# Altium project FAN_Boardv1_040116.PrjPcb
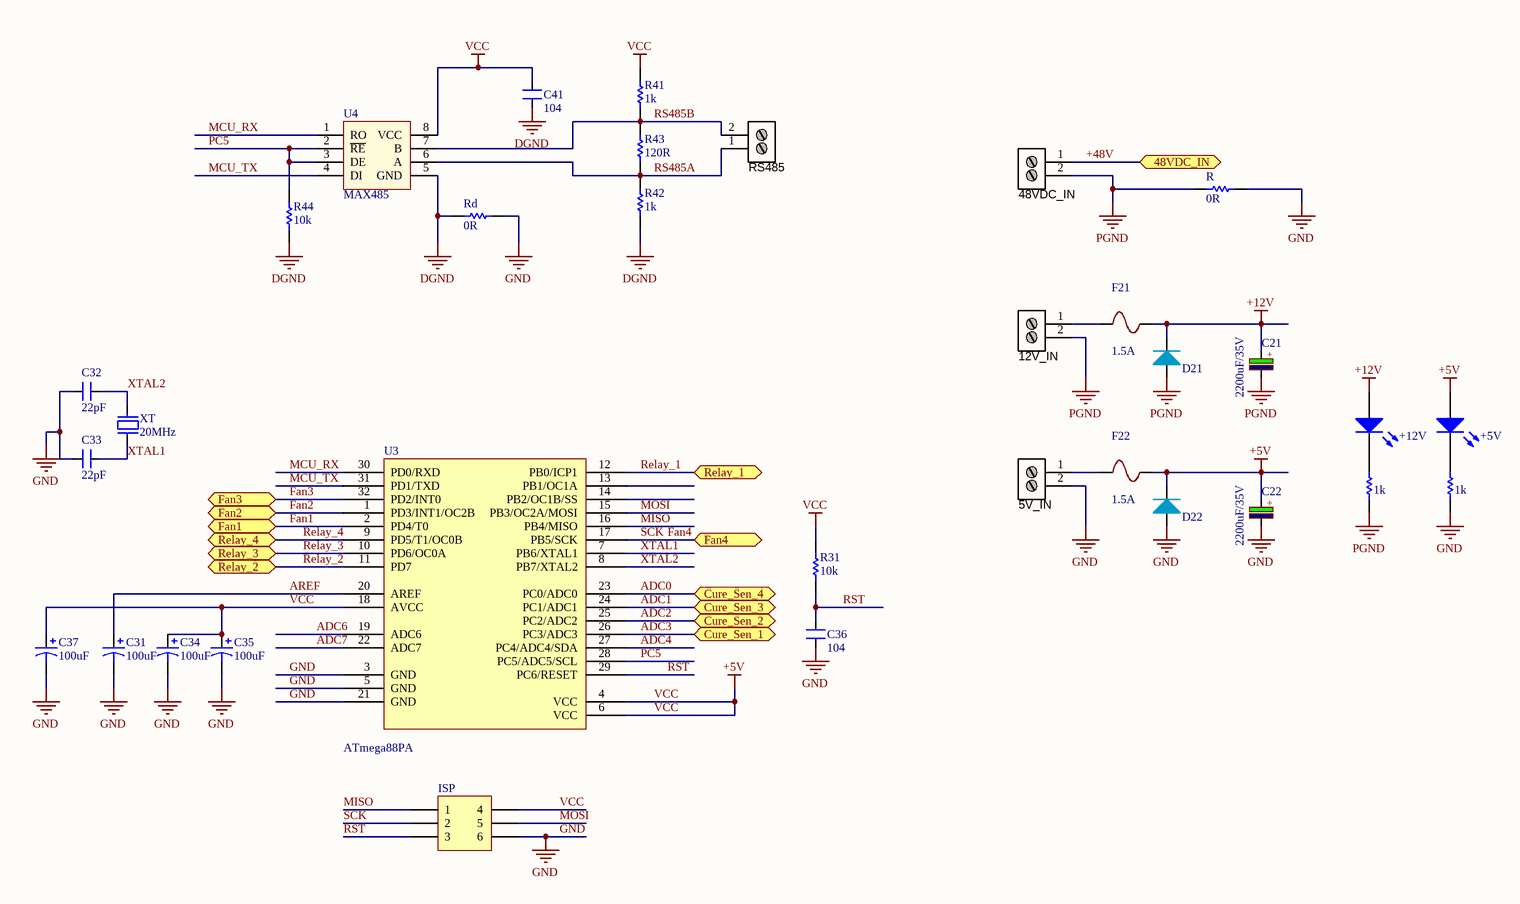
[diagram p0: FAN_Board_Control_v1_040116.SchDoc]
2 sheets, 104 parts. Net scope: flat (ports and power ports of the same name join across sheets).
Board file: FAN_Boardv1_040116.PcbDoc
Sheets:
  FAN_Board_Control_v1_040116.SchDoc
  FAN_Boardv1_RelayAlarm_040116.SchDoc

## Sheet FAN_Board_Control_v1_040116.SchDoc
size A3

### Parts
5V_IN  Stackable ScrewTerm  [2P_PCB_ScrewTerm_200mil]  (value not drawn)
12V_IN  Stackable ScrewTerm  [2P_PCB_ScrewTerm_200mil]  (value not drawn)
48VDC_IN  Stackable ScrewTerm  [2P_PCB_ScrewTerm_200mil]  (value not drawn)
+5V  Led  [LED 5mm RED]  (value not drawn)
+12V  Led  [LED 5mm RED]  (value not drawn)
C21  2200uF/35V  [CP_1000uF_25V]
C22  2200uF/35V  [CP_1000uF_25V]
C31  value 100uF  [CAPC2012N_F]  (hidden comment: Cap)
C32  value 22pF  [CAPC1608N]  (hidden comment: CAP NP)
C33  value 22pF  [CAPC1608N]  (hidden comment: CAP NP)
C34  value 100uF  [CAPC2012N_F]  (hidden comment: Cap)
C35  value 100uF  [CAPC2012N_F]  (hidden comment: Cap)
C36  value 104  [CAPC1608N]  (hidden comment: CAP NP)
C37  value 100uF  [CAPC2012N_F]  (hidden comment: Cap)
C41  value 104  [CAPC2012N_F]  (hidden comment: 100nF/104)
D21  Diode  [DO-214AC]  (value not drawn)
D22  Diode  [DO-214AC]  (value not drawn)
F21  1.5A  [FUSE_SR-5-BK]
F22  1.5A  [FUSE_SR-5-BK]
ISP  Header 3X2A  [HDR2X3_CEN]  (value not drawn)
R  value 0R  [RESTH_AXIAL-0.4]  (hidden comment: Res)
R21  value 1k  [RESC2012N_F]  (hidden comment: Res_0805_1k)
R22  value 1k  [RESC2012N_F]  (hidden comment: Res_0805_1k)
R31  value 10k  [RESC1608N_ZERO]  (hidden comment: Res)
R41  1k  [RESC2012N_F]
R42  1k  [RESC2012N_F]
R43  value 120R  [RESC2012N_F]  (hidden comment: 330R)
R44  value 10k  [RESC2012N_F]  (hidden comment: 330R)
Rd  value 0R  [RESC2012N_F]  (hidden comment: Res)
RS485  Stackable ScrewTerm  [2P_PCB1]  (value not drawn)
U3  ATmega88PA  [32PIN]
U4  MAX485  [SO-8]
XT  20MHz  [XT2]

### Ports
48VDC_IN, Cure_Sen_1, Cure_Sen_2, Cure_Sen_3, Cure_Sen_4, Fan1, Fan2, Fan3, Fan4, Relay_1, Relay_2, Relay_3, Relay_4

### Nets
+12V: +12V.1(A) C21.1 D21.2(K) F21.2
DGND: C41.1 R42.1 R44.1 Rd.1 U4.5(GND)
GND: 5V_IN.2 C22.2 C31.2 C32.2 C33.2 C34.2 C35.2 C36.1 C37.2 D22.1(A) ISP.6 R.2 R22.2 Rd.2 U3.3(GND) U3.5(GND) U3.21(GND)
PGND: 12V_IN.2 48VDC_IN.2 C21.2 D21.1(A) R.1 R21.2
VCC: +5V.1(A) C22.1 C34.1 C35.1 C37.1 C41.2 D22.2(K) F22.2 ISP.4 R31.2 R41.2 U3.4(VCC) U3.6(VCC) U3.18(AVCC) U4.8(VCC)  [also labelled +5V]
+48V: 48VDC_IN.1 ; port 48VDC_IN
ADC0: U3.23(PC0/ADC0) ; port Cure_Sen_4
ADC1: U3.24(PC1/ADC1) ; port Cure_Sen_3
ADC2: U3.25(PC2/ADC2) ; port Cure_Sen_2
ADC3: U3.26(PC3/ADC3) ; port Cure_Sen_1
ADC4: U3.27(PC4/ADC4/SDA)
ADC6: U3.19(ADC6)
ADC7: U3.22(ADC7)
AREF: C31.1 U3.20(AREF)
Fan1: U3.2(PD4/T0) ; port Fan1
Fan2: U3.1(PD3/INT1/OC2B) ; port Fan2
Fan3: U3.32(PD2/INT0) ; port Fan3
Fan4: ISP.2 U3.17(PB5/SCK) ; port Fan4  [also labelled SCK]
MCU_RX: U3.30(PD0/RXD) U4.1(RO)
MCU_TX: U3.31(PD1/TXD) U4.4(DI)
MISO: ISP.1 U3.16(PB4/MISO)
MOSI: ISP.5 U3.15(PB3/OC2A/MOSI)
PC5: R44.2 U3.28(PC5/ADC5/SCL) U4.2(~{RE}) U4.3(DE)
Relay_1: U3.12(PB0/ICP1) ; port Relay_1
Relay_2: U3.11(PD7) ; port Relay_2
Relay_3: U3.10(PD6/OC0A) ; port Relay_3
Relay_4: U3.9(PD5/T1/OC0B) ; port Relay_4
RS485A: R42.2 R43.1 RS485.1 U4.6(A)
RS485B: R41.1 R43.2 RS485.2 U4.7(B)
RST: C36.2 ISP.3 R31.1 U3.29(PC6/RESET)
XTAL1: C33.1 U3.7(PB6/XTAL1) XT.1
XTAL2: C32.1 U3.8(PB7/XTAL2) XT.2
Net5V_IN_1: 5V_IN.1 F22.1
Net12V_IN_1: 12V_IN.1 F21.1
Net+5V_2: +5V.2(K) R22.1
Net+12V_2: +12V.2(K) R21.1

Not connected (* = marked no-connect by the designer): U3 13(PB1/OC1A) 14(PB2/OC1B/SS)

### Notes on the sheet
- (in symbol CP4) +

### Library data of the parts
5V_IN 12V_IN 48VDC_IN RS485 = 2P_ScrewTerm_90S_3.81MM: Terminal Block Screw Type THT 2-Position 3.81mm pitch; Manufacturer 1: Tyco Electronics; Manufacturer Part Number 1: 1776113-2; Value: 2 position; Pitch: 0.150" (3.81mm); Positions Per Level: 2; Package / Case: Side Entry; 3.81mm pitch; Category: Connectors Interconnects; Color: Black; Supplier 1: Digi-Key; Supplier Part Number 1: A97976-ND
+5V +12V = Led: pin to pad: 1>A 2>K
C21 C22 = CP4: Cap 1000uF/16V - 220uF/50V; Description 5: 4,7uF>10uF/250V_3,3uF>10uF/400V - 2,2uF>4,7uF/450V; Description 1: 2200uF-3300uF/6,3V - 1000uF-2200uF/10V; Description 2: 1000uF/16V - 470uF => 1000uF/25V - 100uF/100V; Description 3: 330uF>470uF/35V_220uF>470uF/50V_10uF>22uF/250V; Description 4: 220uF => 330uF/63V - 10uF =>33uF/160 - 200V; Value: 1000uF/16V
C41 = CAP NP
D21 D22 = Diode: pin to pad: 1>A 2>K
F21 F22 = Fuse
ISP = Header 3X2A: Header, 3-Pin, Dual row; LatestRevisionDate: 17-Jul-2002; LatestRevisionNote: Re-released for DXP Platform.; Publisher: Altium Limited
R21 R22 = Res
R41-R44 = Res: Tro dan
  R41 R42: Value: 1k
U3 = ATmega48/168/328
U4 = MAX485: RS232 - RS485 (Same sn75176)
XT = Crystal

## Sheet FAN_Boardv1_RelayAlarm_040116.SchDoc
size A3
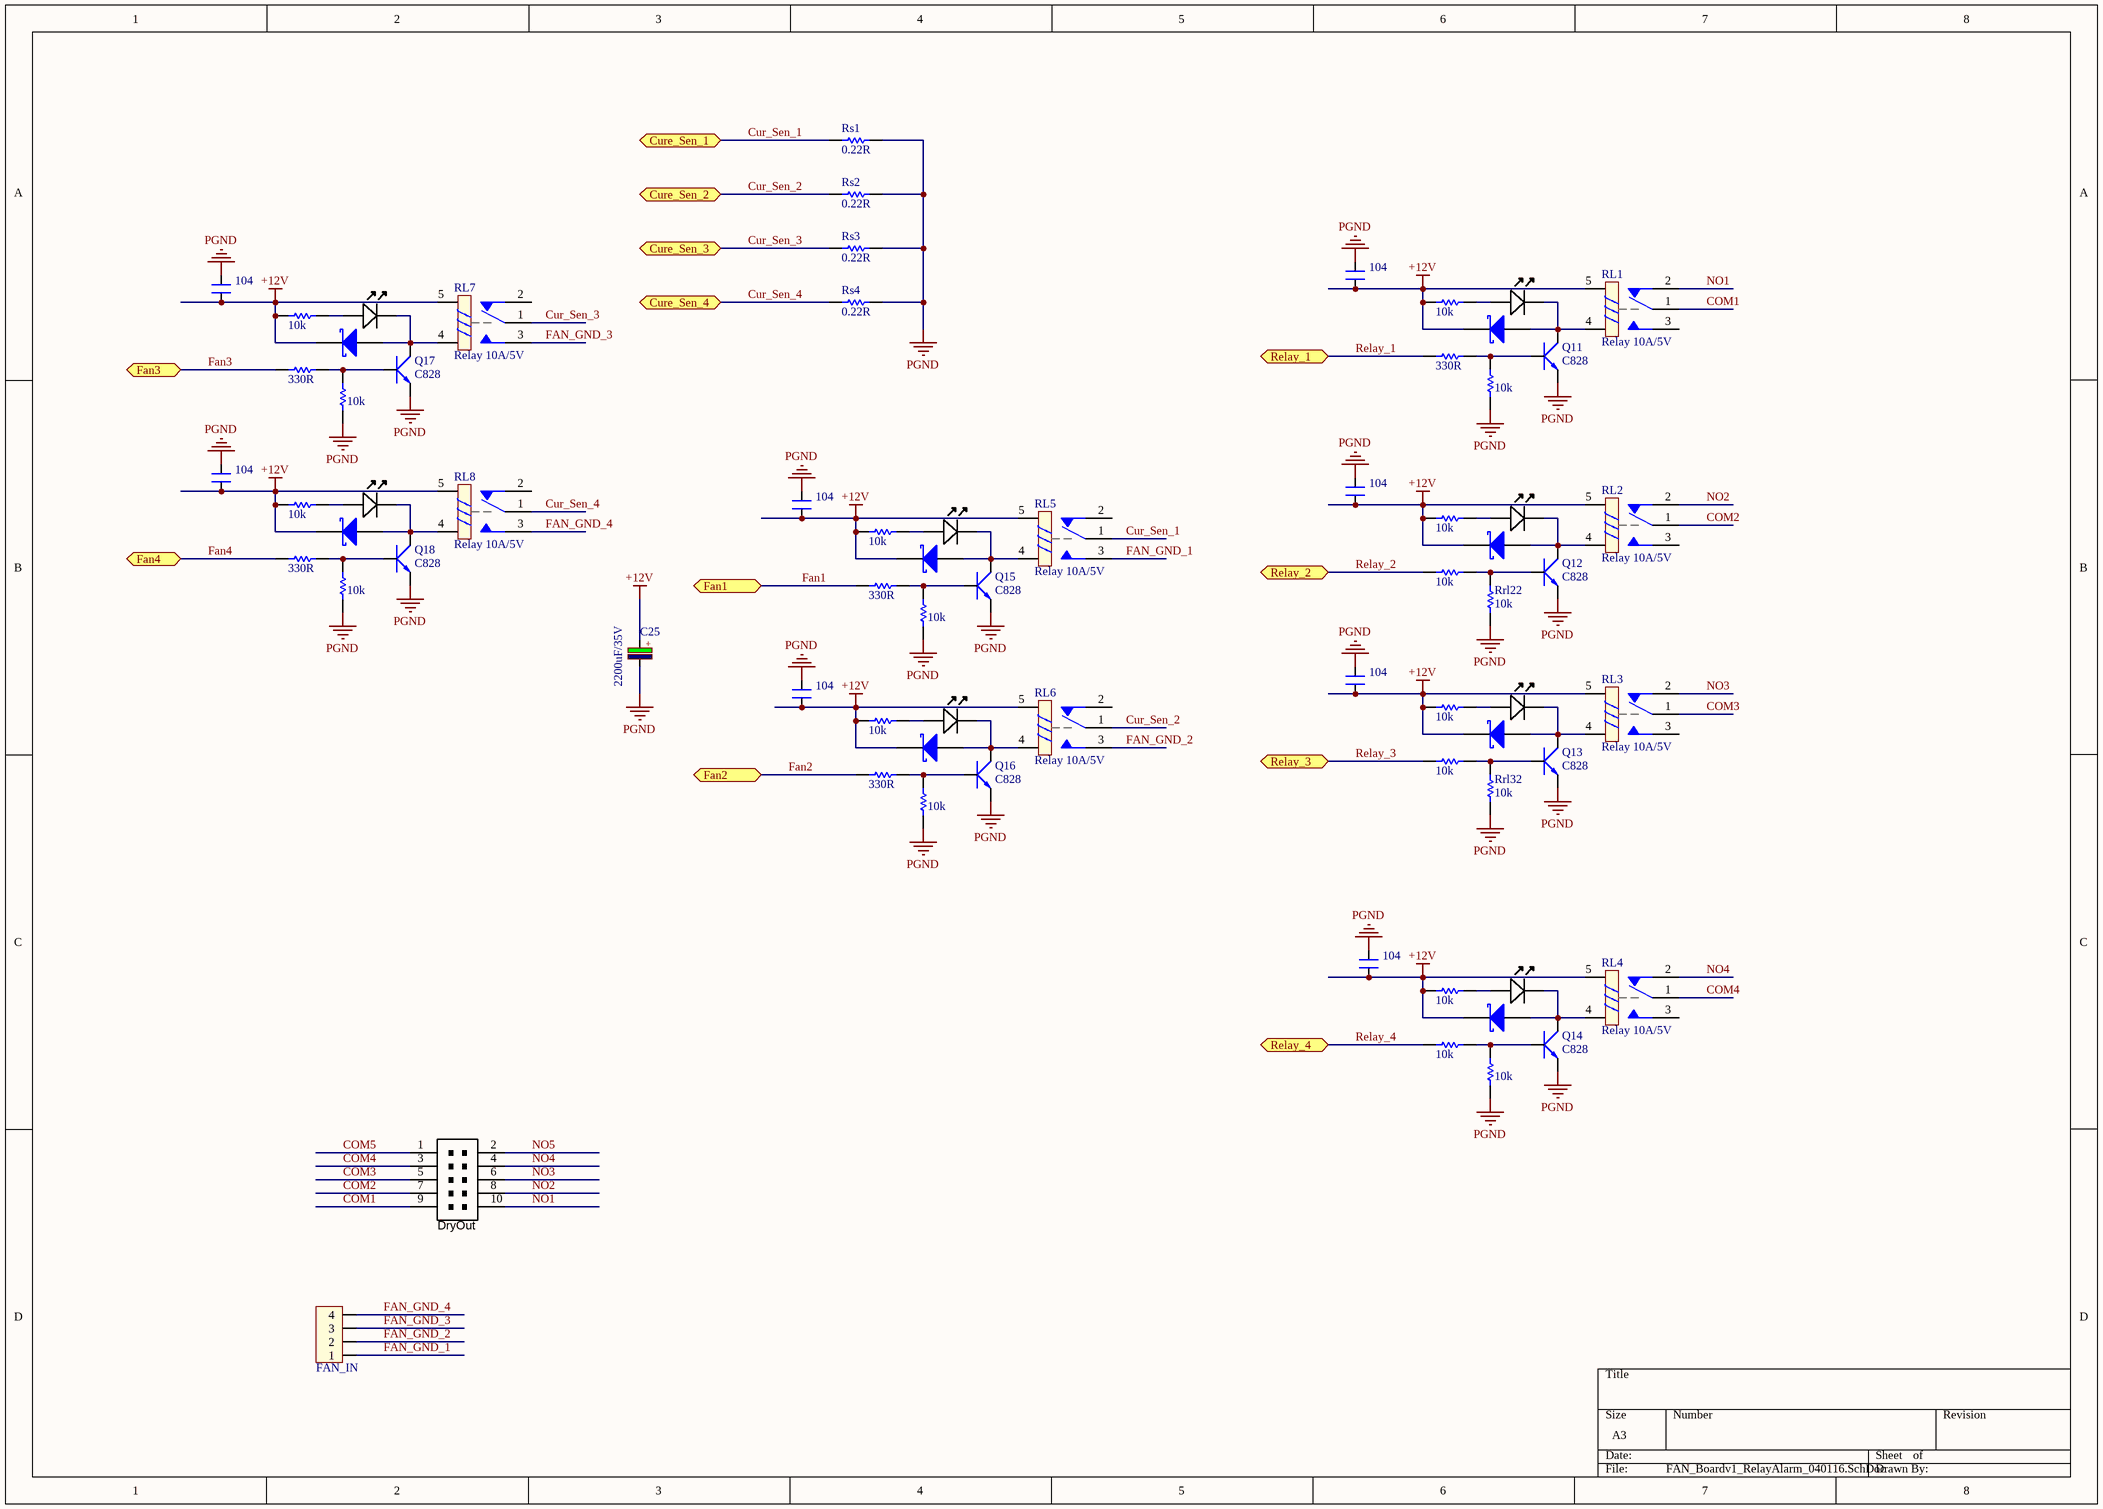
[diagram p1: FAN_Boardv1_RelayAlarm_040116.SchDoc]

### Parts
C25  2200uF/35V  [CP_1000uF_25V]
Crl1  value 104  [CAPC2012N_F]  (hidden comment: CAP NP)
Crl2  value 104  [CAPC2012N_F]  (hidden comment: CAP NP)
Crl3  value 104  [CAPC2012N_F]  (hidden comment: CAP NP)
Crl4  value 104  [CAPC2012N_F]  (hidden comment: CAP NP)
Crl5  value 104  [CAPC2012N_F]  (hidden comment: CAP NP)
Crl6  value 104  [CAPC2012N_F]  (hidden comment: CAP NP)
Crl7  value 104  [CAPC2012N_F]  (hidden comment: CAP NP)
Crl8  value 104  [CAPC2012N_F]  (hidden comment: CAP NP)
D11  Diode  [DO-214AC]  (value not drawn)
D12  Diode  [DO-214AC]  (value not drawn)
D13  Diode  [DO-214AC]  (value not drawn)
D14  Diode  [DO-214AC]  (value not drawn)
D15  Diode  [DO-214AC]  (value not drawn)
D16  Diode  [DO-214AC]  (value not drawn)
D17  Diode  [DO-214AC]  (value not drawn)
D18  Diode  [DO-214AC]  (value not drawn)
DryOut  shrouded box header  [10P_PCB_HEADER_BRD_MNT]  (value not drawn)
E1  Blue  [LED-0805-A]  (value not drawn)
E2  Blue  [LED-0805-A]  (value not drawn)
E3  Blue  [LED-0805-A]  (value not drawn)
E4  Blue  [LED-0805-A]  (value not drawn)
E5  Blue  [LED-0805-A]  (value not drawn)
E6  Blue  [LED-0805-A]  (value not drawn)
E7  Blue  [LED-0805-A]  (value not drawn)
E8  Blue  [LED-0805-A]  (value not drawn)
FAN_IN  Header 4  [HED4]  (value not drawn)
Q11  C828  [SOT23 TOP]
Q12  C828  [SOT23 TOP]
Q13  C828  [SOT23 TOP]
Q14  C828  [SOT23 TOP]
Q15  C828  [SOT23 TOP]
Q16  C828  [SOT23 TOP]
Q17  C828  [SOT23 TOP]
Q18  C828  [SOT23 TOP]
RL1  Relay 10A/5V  [RL_5PIN]
RL2  Relay 10A/5V  [RL_5PIN]
RL3  Relay 10A/5V  [RL_5PIN]
RL4  Relay 10A/5V  [RL_5PIN]
RL5  Relay 10A/5V  [RL_5PIN]
RL6  Relay 10A/5V  [RL_5PIN]
RL7  Relay 10A/5V  [RL_5PIN]
RL8  Relay 10A/5V  [RL_5PIN]
Rl52  value 10k  [RESC1608N_ZERO]  (hidden comment: Res)
Rrl11  value 330R  [RESC1608N_ZERO]  (hidden comment: Res)
Rrl12  value 10k  [RESC1608N_ZERO]  (hidden comment: Res)
Rrl13  value 10k  [RESC1608N_ZERO]  (hidden comment: Res)
Rrl21  value 10k  [RESC1608N_ZERO]  (hidden comment: Res)
Rrl22  value 10k  [RESC1608N_ZERO]  (hidden comment: Res)
Rrl23  value 10k  [RESC1608N_ZERO]  (hidden comment: Res)
Rrl31  value 10k  [RESC1608N_ZERO]  (hidden comment: Res)
Rrl32  value 10k  [RESC1608N_ZERO]  (hidden comment: Res)
Rrl33  value 10k  [RESC1608N_ZERO]  (hidden comment: Res)
Rrl41  value 10k  [RESC1608N_ZERO]  (hidden comment: Res)
Rrl42  value 10k  [RESC1608N_ZERO]  (hidden comment: Res)
Rrl43  value 10k  [RESC1608N_ZERO]  (hidden comment: Res)
Rrl51  value 330R  [RESC1608N_ZERO]  (hidden comment: Res)
Rrl53  value 10k  [RESC1608N_ZERO]  (hidden comment: Res)
Rrl61  value 330R  [RESC1608N_ZERO]  (hidden comment: Res)
Rrl62  value 10k  [RESC1608N_ZERO]  (hidden comment: Res)
Rrl63  value 10k  [RESC1608N_ZERO]  (hidden comment: Res)
Rrl71  value 330R  [RESC1608N_ZERO]  (hidden comment: Res)
Rrl72  value 10k  [RESC1608N_ZERO]  (hidden comment: Res)
Rrl73  value 10k  [RESC1608N_ZERO]  (hidden comment: Res)
Rrl81  value 330R  [RESC1608N_ZERO]  (hidden comment: Res)
Rrl82  value 10k  [RESC1608N_ZERO]  (hidden comment: Res)
Rrl83  value 10k  [RESC1608N_ZERO]  (hidden comment: Res)
Rs1  value 0.22R  [RESTH_AXIAL-0.4]  (hidden comment: Res)
Rs2  value 0.22R  [RESTH_AXIAL-0.4]  (hidden comment: Res)
Rs3  value 0.22R  [RESTH_AXIAL-0.4]  (hidden comment: Res)
Rs4  value 0.22R  [RESTH_AXIAL-0.4]  (hidden comment: Res)

### Ports
Cure_Sen_1, Cure_Sen_2, Cure_Sen_3, Cure_Sen_4, Fan1, Fan2, Fan3, Fan4, Relay_1, Relay_2, Relay_3, Relay_4

### Nets
+12V: C25.1 Crl1.1 Crl2.1 Crl3.1 Crl4.1 Crl5.1 Crl6.1 Crl7.1 Crl8.1 D11.2(K) D12.2(K) D13.2(K) D14.2(K) D15.2(K) D16.2(K) D17.2(K) D18.2(K) RL1.5 RL2.5 RL3.5 RL4.5 RL5.5 RL6.5 RL7.5 RL8.5 Rrl13.2 Rrl23.2 Rrl33.2 Rrl43.2 Rrl53.2 Rrl63.2 Rrl73.2 Rrl83.2
PGND: C25.2 Crl1.2 Crl2.2 Crl3.2 Crl4.2 Crl5.2 Crl6.2 Crl7.2 Crl8.2 Q11.3(E) Q12.3(E) Q13.3(E) Q14.3(E) Q15.3(E) Q16.3(E) Q17.3(E) Q18.3(E) Rl52.1 Rrl12.1 Rrl22.1 Rrl32.1 Rrl42.1 Rrl62.1 Rrl72.1 Rrl82.1 Rs1.1 Rs2.1 Rs3.1 Rs4.1
COM1: DryOut.9 RL1.1
COM2: DryOut.7 RL2.1
COM3: DryOut.5 RL3.1
COM4: DryOut.3 RL4.1
COM5: DryOut.1
Cur_Sen_1: RL5.1 Rs1.2 ; port Cure_Sen_1  [project net ADC3]
Cur_Sen_2: RL6.1 Rs2.2 ; port Cure_Sen_2  [project net ADC2]
Cur_Sen_3: RL7.1 Rs3.2 ; port Cure_Sen_3  [project net ADC1]
Cur_Sen_4: RL8.1 Rs4.2 ; port Cure_Sen_4  [project net ADC0]
Fan1: Rrl51.1 ; port Fan1
Fan2: Rrl61.1 ; port Fan2
Fan3: Rrl71.1 ; port Fan3
Fan4: Rrl81.1 ; port Fan4
FAN_GND_1: FAN_IN.1 RL5.3
FAN_GND_2: FAN_IN.2 RL6.3
FAN_GND_3: FAN_IN.3 RL7.3
FAN_GND_4: FAN_IN.4 RL8.3
NO1: DryOut.10 RL1.2
NO2: DryOut.8 RL2.2
NO3: DryOut.6 RL3.2
NO4: DryOut.4 RL4.2
NO5: DryOut.2
Relay_1: Rrl11.1 ; port Relay_1
Relay_2: Rrl21.1 ; port Relay_2
Relay_3: Rrl31.1 ; port Relay_3
Relay_4: Rrl41.1 ; port Relay_4
NetD11_1: D11.1(A) E1.K Q11.2(C) RL1.4
NetD12_1: D12.1(A) E2.K Q12.2(C) RL2.4
NetD13_1: D13.1(A) E3.K Q13.2(C) RL3.4
NetD14_1: D14.1(A) E4.K Q14.2(C) RL4.4
NetD15_1: D15.1(A) E5.K Q15.2(C) RL5.4
NetD16_1: D16.1(A) E6.K Q16.2(C) RL6.4
NetD17_1: D17.1(A) E7.K Q17.2(C) RL7.4
NetD18_1: D18.1(A) E8.K Q18.2(C) RL8.4
NetE1_A: E1.A Rrl13.1
NetE2_A: E2.A Rrl23.1
NetE3_A: E3.A Rrl33.1
NetE4_A: E4.A Rrl43.1
NetE5_A: E5.A Rrl53.1
NetE6_A: E6.A Rrl63.1
NetE7_A: E7.A Rrl73.1
NetE8_A: E8.A Rrl83.1
NetQ11_1: Q11.1(B) Rrl11.2 Rrl12.2
NetQ12_1: Q12.1(B) Rrl21.2 Rrl22.2
NetQ13_1: Q13.1(B) Rrl31.2 Rrl32.2
NetQ14_1: Q14.1(B) Rrl41.2 Rrl42.2
NetQ15_1: Q15.1(B) Rl52.2 Rrl51.2
NetQ16_1: Q16.1(B) Rrl61.2 Rrl62.2
NetQ17_1: Q17.1(B) Rrl71.2 Rrl72.2
NetQ18_1: Q18.1(B) Rrl81.2 Rrl82.2

Not connected (* = marked no-connect by the designer): RL1 3; RL2 3; RL3 3; RL4 3; RL5 2; RL6 2; RL7 2; RL8 2

### Notes on the sheet
- (in symbol CP4) +

### Library data of the parts
C25 = CP4: as C21 on sheet FAN_Board_Control_v1_040116; Value: 1000uF/16V
D11-D18 = Diode: pin to pad: 1>A 2>K
DryOut = CONN_HEADER_2x5P_0.100in_Male: Header THD 10 POS Double-row 2.54mm pitch; Manufacturer 1: 3M; Manufacturer Part Number 1: D2510-6002-AR; Pitch: 0.100" (2.54mm); Value: Double-row, 10 positions; QtyOverride: 1; Connector Type: Header, Shrouded; Number of Positions: 10; Package / Case: Connector header; 2.54mm pitch; Contact Type: Male Pin; Number of Rows: 2; Row Spacing: 0.100" (2.54mm); Contact Mating Length: 0.243" (6.17mm); ComponentLink1URL: http://multimedia.3m.com/mws/mediawebserver?66666UuZjcFSLXTtm8T_oxMcEVuQEcuZgVs6EVs6E666666--; ComponentLink1Description: http://multimedia.3m.com/mws/mediawebserver?66666UuZjcFSLXTtm8T_oxMcEVuQEcuZgVs6EVs6E666666--; Supplier 1: Digi-Key; Supplier Part Number 1: MHC10E-ND
E1-E8 = LED_SMD_Blue_0805_100mcd: LED 0805 SMD Blue 100mcd 470nm; Manufacturer 1: Ligitek; Manufacturer Part Number 1: LG-170DBKZ-CT; Ratings: 100 mcd; 470 nm; Package / Case: 0805; Material: InGaN/GaN; Value: Blue; Color: Blue
FAN_IN = Hed4: Header 4 (Green); Value: Header 4
Q11-Q18 = NPN: Transistor C828 C1815....
RL1-RL8 = Relay 1: Relay SPDT,10A - 12VDC 5 Pin; Value: Relay SPDT, 10A, 12V

## Nets that join several sheets
+12V: FAN_Board_Control_v1_040116 (+12V.1 C21.1 D21.2 F21.2), FAN_Boardv1_RelayAlarm_040116 (33 pins)
PGND: FAN_Board_Control_v1_040116 (6 pins), FAN_Boardv1_RelayAlarm_040116 (29 pins)
ADC0: FAN_Board_Control_v1_040116 (U3.23), FAN_Boardv1_RelayAlarm_040116 (RL8.1 Rs4.2)
ADC1: FAN_Board_Control_v1_040116 (U3.24), FAN_Boardv1_RelayAlarm_040116 (RL7.1 Rs3.2)
ADC2: FAN_Board_Control_v1_040116 (U3.25), FAN_Boardv1_RelayAlarm_040116 (RL6.1 Rs2.2)
ADC3: FAN_Board_Control_v1_040116 (U3.26), FAN_Boardv1_RelayAlarm_040116 (RL5.1 Rs1.2)
Fan1: FAN_Board_Control_v1_040116 (U3.2), FAN_Boardv1_RelayAlarm_040116 (Rrl51.1)
Fan2: FAN_Board_Control_v1_040116 (U3.1), FAN_Boardv1_RelayAlarm_040116 (Rrl61.1)
Fan3: FAN_Board_Control_v1_040116 (U3.32), FAN_Boardv1_RelayAlarm_040116 (Rrl71.1)
Fan4: FAN_Board_Control_v1_040116 (ISP.2 U3.17), FAN_Boardv1_RelayAlarm_040116 (Rrl81.1)
Relay_1: FAN_Board_Control_v1_040116 (U3.12), FAN_Boardv1_RelayAlarm_040116 (Rrl11.1)
Relay_2: FAN_Board_Control_v1_040116 (U3.11), FAN_Boardv1_RelayAlarm_040116 (Rrl21.1)
Relay_3: FAN_Board_Control_v1_040116 (U3.10), FAN_Boardv1_RelayAlarm_040116 (Rrl31.1)
Relay_4: FAN_Board_Control_v1_040116 (U3.9), FAN_Boardv1_RelayAlarm_040116 (Rrl41.1)